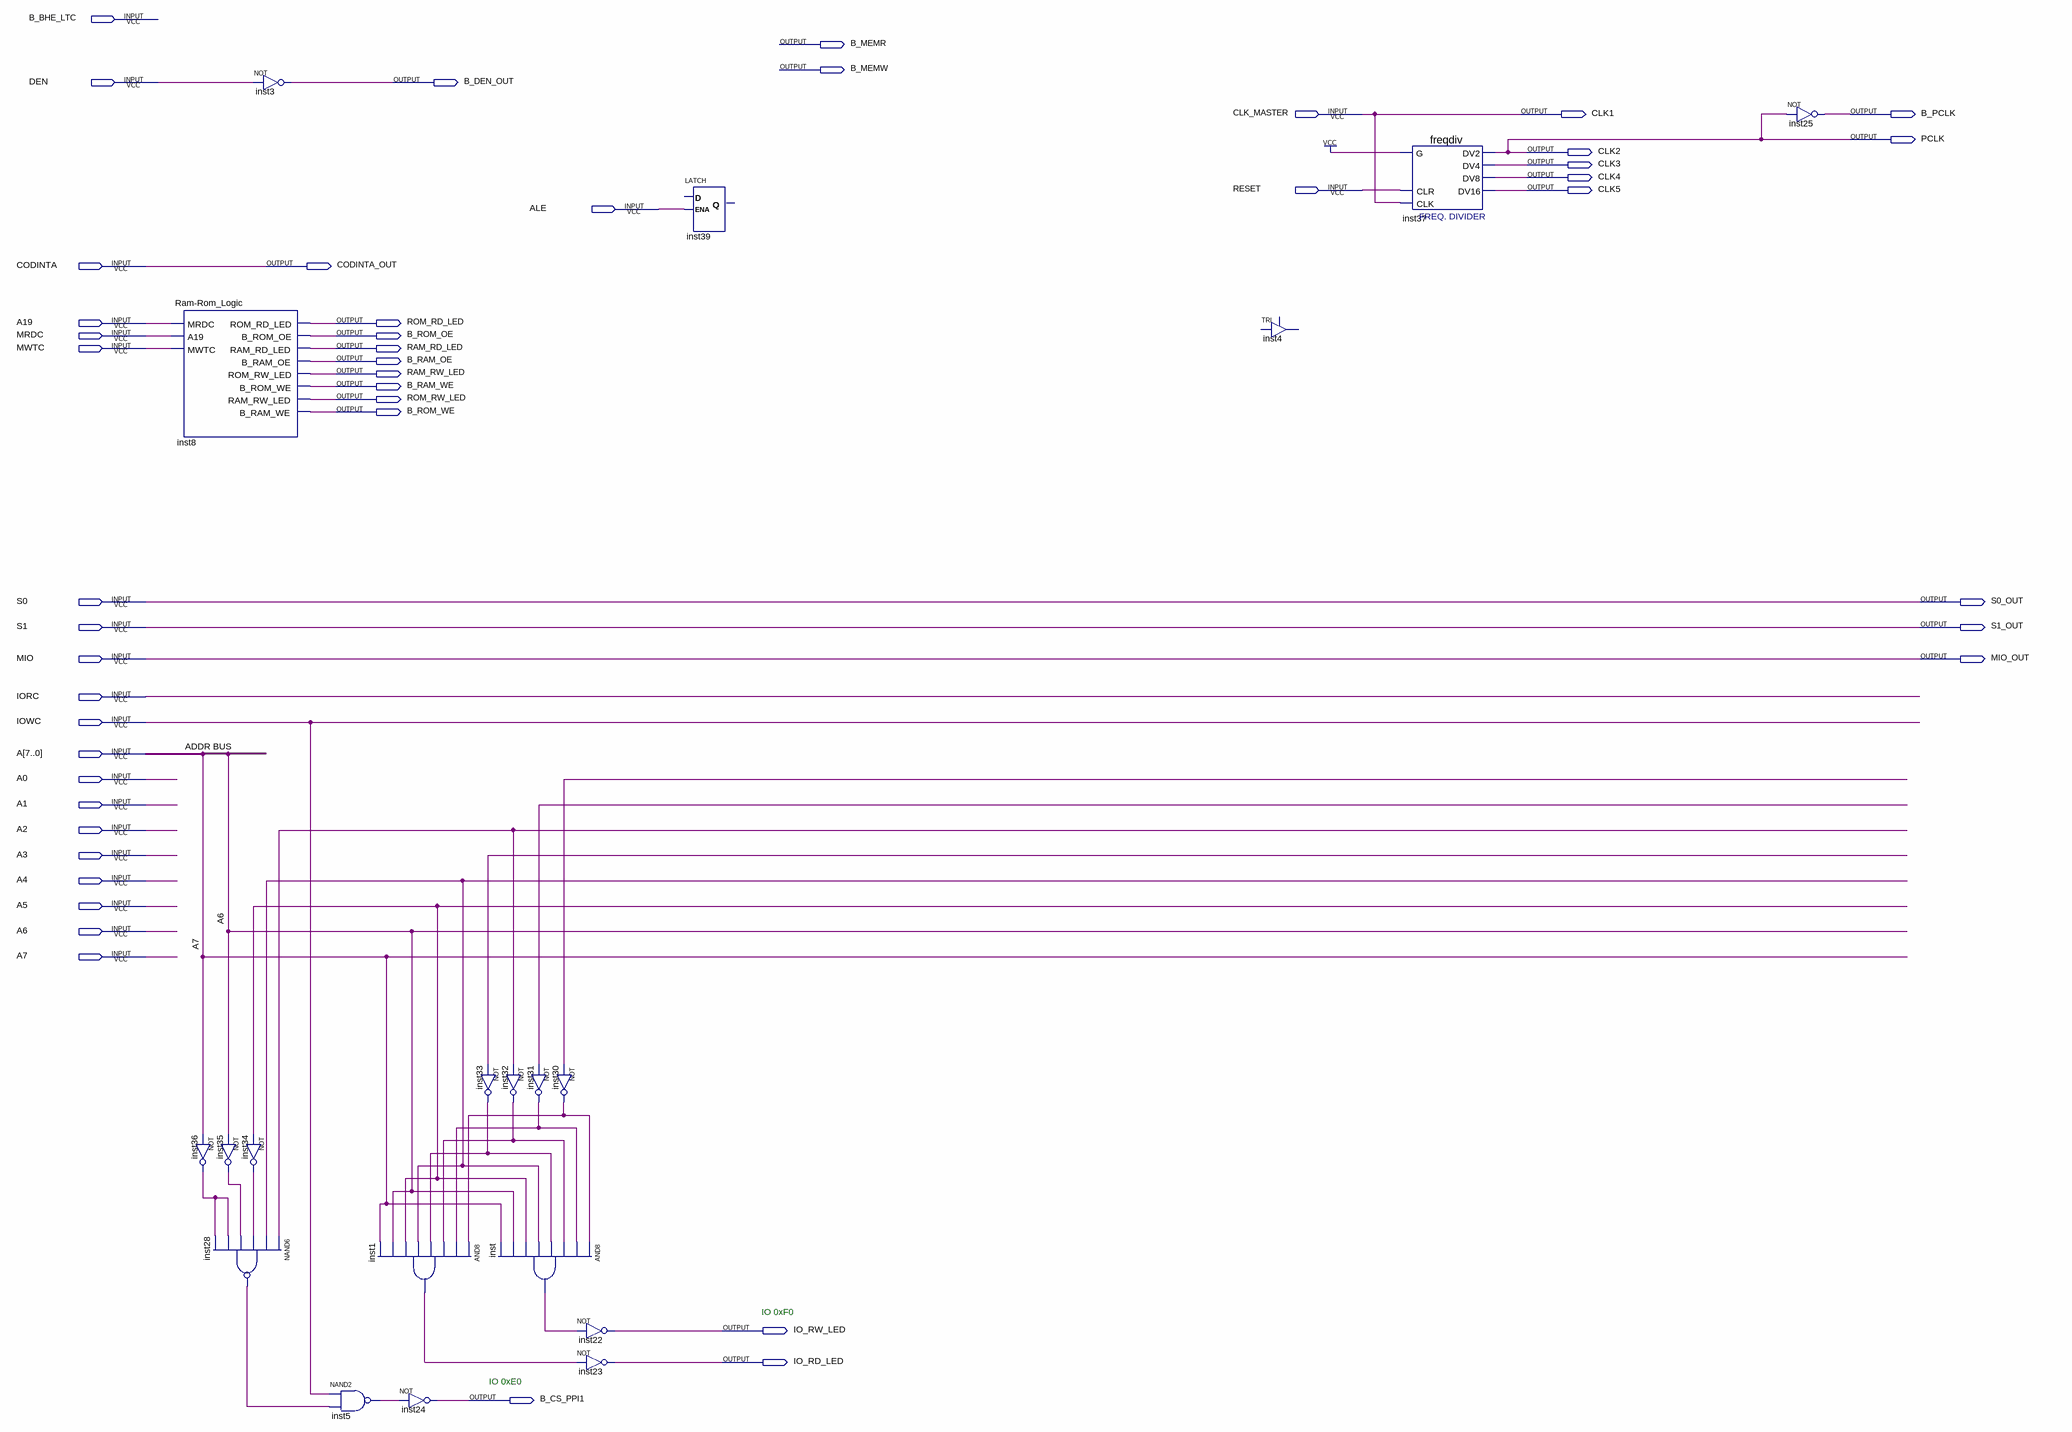
[diagram p0: schematic sheet]
// Quartus schematic ChipSet.bdf as structural Verilog: 20 symbols, 48 pins
module ChipSet (
  input  B_BHE_LTC,
  input  DEN,
  input  CLK_MASTER,
  input  RESET,
  input  ALE,
  input  CODINTA,
  input  A19,
  input  MRDC,
  input  MWTC,
  input  S0,
  input  S1,
  input  MIO,
  input  IORC,
  input  IOWC,
  input  [7:0] A,
  input  A0,
  input  A1,
  input  A2,
  input  A3,
  input  A4,
  input  A5,
  input  A6,
  input  A7,
  output B_MEMR,
  output B_MEMW,
  output B_DEN_OUT,
  output CLK1,
  output B_PCLK,
  output PCLK,
  output CLK2,
  output CLK3,
  output CLK4,
  output CLK5,
  output CODINTA_OUT,
  output ROM_RD_LED,
  output B_ROM_OE,
  output RAM_RD_LED,
  output B_RAM_OE,
  output RAM_RW_LED,
  output B_RAM_WE,
  output ROM_RW_LED,
  output B_ROM_WE,
  output S0_OUT,
  output S1_OUT,
  output MIO_OUT,
  output IO_RW_LED,
  output IO_RD_LED,
  output B_CS_PPI1
);

  wire inst1_out, inst5_out, inst28_out, inst30_out, inst31_out, inst32_out, inst33_out, inst34_out,
       inst35_out, inst36_out, inst_out, undriven, undriven_2, undriven_3, undriven_4, undriven_5, undriven_6;

  \Ram-Rom_Logic  inst8 (
    .MRDC(A19), .A19(MRDC), .MWTC(MWTC), .ROM_RD_LED(ROM_RD_LED), .B_ROM_OE(B_ROM_OE),
    .RAM_RD_LED(RAM_RD_LED), .B_RAM_OE(B_RAM_OE), .ROM_RW_LED(RAM_RW_LED), .B_ROM_WE(B_RAM_WE),
    .RAM_RW_LED(ROM_RW_LED), .B_RAM_WE(B_ROM_WE));
  not inst35 (inst35_out, A6);
  not inst36 (inst36_out, A7);
  nand inst28 (inst28_out, undriven_6, undriven_5, inst34_out, inst35_out, inst36_out, inst36_out);
  not inst3 (B_DEN_OUT, DEN);
  not inst34 (inst34_out, undriven_4);
  and inst1 (inst1_out, inst30_out, inst31_out, inst32_out, inst33_out, undriven_5, undriven_4, A6, A7);
  nand inst5 (inst5_out, IOWC, inst28_out);
  not inst24 (B_CS_PPI1, inst5_out);
  not inst33 (inst33_out, undriven_3);
  not inst31 (inst31_out, undriven_2);
  not inst32 (inst32_out, undriven_6);
  and inst (inst_out, inst30_out, inst31_out, inst32_out, inst33_out, undriven_5, undriven_4, A6, A7);
  not inst30 (inst30_out, undriven);
  not inst22 (IO_RW_LED, inst_out);
  not inst23 (IO_RD_LED, inst1_out);
  LATCH inst39 (.ENA(ALE));  // open: D, Q
  TRI inst4 ();  // open: IN, OE, OUT
  freqdiv inst37 (.CLK(CLK_MASTER), .CLR(RESET), .G(1'b1), .DV2(CLK2), .DV4(CLK3), .DV8(CLK4), .DV16(CLK5));
  not inst25 (B_PCLK, CLK2);

  assign CLK1 = CLK_MASTER;
  assign CODINTA_OUT = CODINTA;
  assign MIO_OUT = MIO;
  assign PCLK = CLK2;
  assign S0_OUT = S0;
  assign S1_OUT = S1;

  // Notes on the sheet:
  //   IO 0xF0
  //   IO 0xE0
endmodule
